# Altium schematic sheet On-Off Switch.SchDoc
size A; SheetNumber: 3; SheetTotal: 14
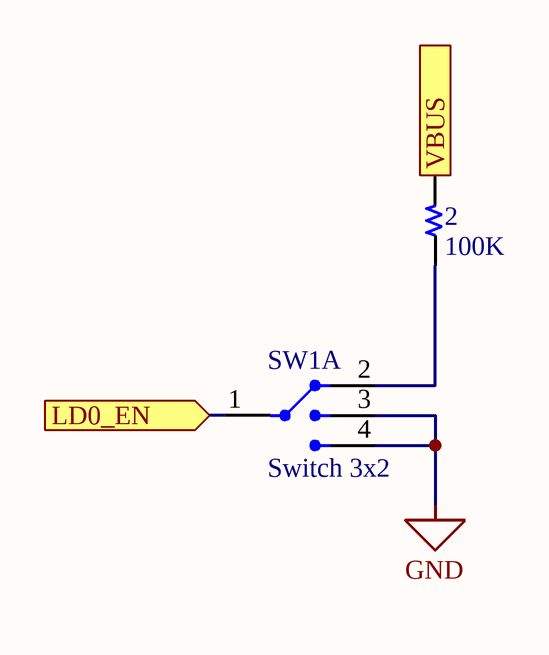
[diagram p0: On-Off Switch.SchDoc]

## Parts
2  100K  [R 0805]
SW1  Switch 3x2  [SW3X2]  (part A of 2)

## Ports
LD0_EN (in, see ESP32[3B], Regulator 3.3V[1B]), VBUS (in, see ESP32[3B], Battery Charging[3B], Regulator 3.3V[1B], USB Input[3B])

## Nets
GND: SW1.3(I/O2) SW1.4(I/O3)
LD0_EN: SW1.1(Com) ; port LD0_EN
VBUS: 2.2 ; port VBUS
Net2_1: 2.1 SW1.2(I/O1)

## Library data of the parts
2 = Resistor
SW1 = SW3x2: Value: Switch 4x2